# Altium schematic sheet OneMotor.SchDoc
size A4; Author: Zhang YuXiang; DrawnBy: Zhang YuXiang; Engineer: Zhang YuXiang
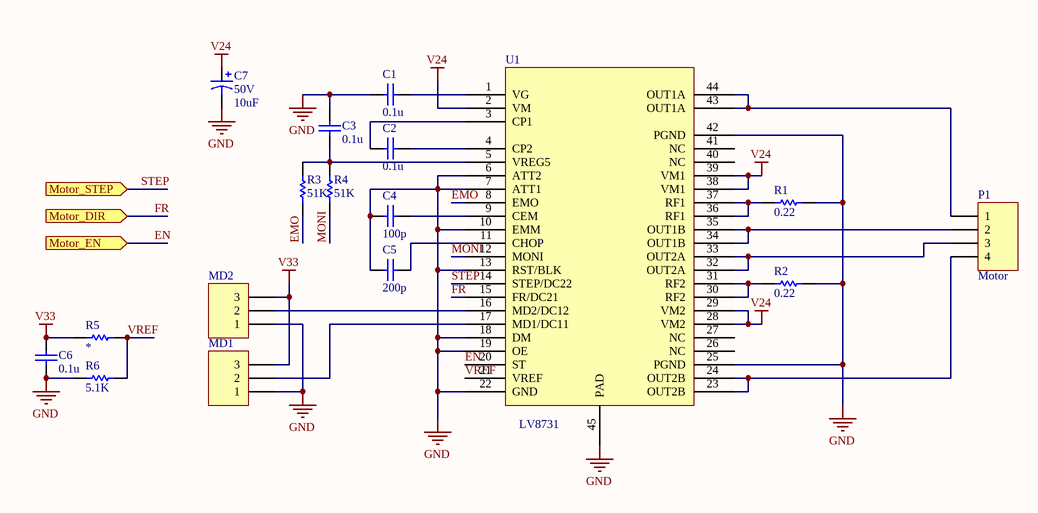
[diagram p0: OneMotor.SchDoc]

## Parts
C1  value 0.1u  [C-1608[0603]]  (hidden comment: Cap Semi)
C2  value 0.1u  [C-1608[0603]]  (hidden comment: Cap Semi)
C3  value 0.1u  [C-1608[0603]]  (hidden comment: Cap Semi)
C4  value 100p  [C-1608[0603]]  (hidden comment: Cap Semi)
C5  value 200p  [C-1608[0603]]  (hidden comment: Cap Semi)
C6  value 0.1u  [C-1608[0603]]  (hidden comment: Cap Semi)
C7  50V  value 10uF  [RB.1/.25]
MD1  Header 3  [shortPad]  (value not drawn)
MD2  Header 3  [shortPad]  (value not drawn)
P1  Motor  [HDR1X4]
R1  value 0.22  [R-6332[2512]]  (hidden comment: Res Semi)
R2  value 0.22  [R-6332[2512]]  (hidden comment: Res Semi)
R3  value 51K  [R-1608[0603]]  (hidden comment: Res Semi)
R4  value 51K  [R-1608[0603]]  (hidden comment: Res Semi)
R5  Res Semi  [R-1608[0603]]  (value not drawn)
R6  value 5.1K  [R-1608[0603]]  (hidden comment: Res Semi)
U1  LV8731  [LV8731_V3]

## Ports
Motor_DIR (in), Motor_EN (in), Motor_STEP (in)

## Nets
GND: C1.2 C3.1 C4.1 C5.1 C6.1 C7.2 MD1.1 MD2.1 R1.1 R2.1 R6.1 U1.6(ATT2) U1.7(ATT1) U1.10(EMM) U1.13(RST/BLK) U1.18(DM) U1.19(OE) U1.22(GND) U1.25(PGND) U1.42(PGND) U1.45(PAD)
V24: C7.1 U1.2(VM) U1.28(VM2) U1.29(VM2) U1.38(VM1) U1.39(VM1)
V33: C6.2 MD1.3 MD2.3 R5.1
EMO: R3.1 U1.8(EMO)
EN: U1.20(ST) ; port Motor_EN
FR: U1.15(FR/DC21) ; port Motor_DIR
MONI: R4.1 U1.12(MONI)
STEP: U1.14(STEP/DC22) ; port Motor_STEP
VREF: R5.2 R6.2 U1.21(VREF)
NetC1_1: C1.1 U1.1(VG)
NetC2_1: C2.1 U1.4(CP2)
NetC2_2: C2.2 U1.3(CP1)
NetC3_2: C3.2 R3.2 R4.2 U1.5(VREG5)
NetC4_2: C4.2 U1.9(CEM)
NetC5_2: C5.2 U1.11(CHOP)
NetMD1_2: MD1.2 U1.17(MD1/DC11)
NetMD2_2: MD2.2 U1.16(MD2/DC12)
NetP1_1: P1.1 U1.43(OUT1A) U1.44(OUT1A)
NetP1_2: P1.2 U1.34(OUT1B) U1.35(OUT1B)
NetP1_3: P1.3 U1.32(OUT2A) U1.33(OUT2A)
NetP1_4: P1.4 U1.23(OUT2B) U1.24(OUT2B)
NetR1_2: R1.2 U1.36(RF1) U1.37(RF1)
NetR2_2: R2.2 U1.30(RF2) U1.31(RF2)

Not connected (* = marked no-connect by the designer): U1 26(NC) 27(NC) 40(NC) 41(NC)

## Library data of the parts
C1-C6 = Cap Semi: Capacitor (Semiconductor SIM Model); Published: 8-Jun-2000; LatestRevisionDate: 17-Jul-2002; LatestRevisionNote: Re-released for DXP Platform.; PackageReference: C1206; Publisher: Altium Limited
C7 = Cap Pol1: Polarized Capacitor (Radial); Published: 8-Jun-2000; LatestRevisionDate: 17-Jul-2002; LatestRevisionNote: Re-released for DXP Platform.; PackageReference: RB7.6-15; Publisher: Altium Limited
MD1 MD2 = Header 3: Header, 3-Pin; LatestRevisionDate: 17-Jul-2002; LatestRevisionNote: Re-released for DXP Platform.; Publisher: Altium Limited
P1 = Header 4: Header, 4-Pin; LatestRevisionDate: 17-Jul-2002; LatestRevisionNote: Re-released for DXP Platform.; Publisher: Altium Limited
R1-R6 = Res Semi: Semiconductor Resistor; Published: 8-Jun-2000; LatestRevisionDate: 17-Jul-2002; LatestRevisionNote: Re-released for DXP Platform.; PackageReference: AXIAL-0.5; Publisher: Altium Limited
  R5: Value: *